# EAGLE design AmpliTR (EAGLE 7.2.0)
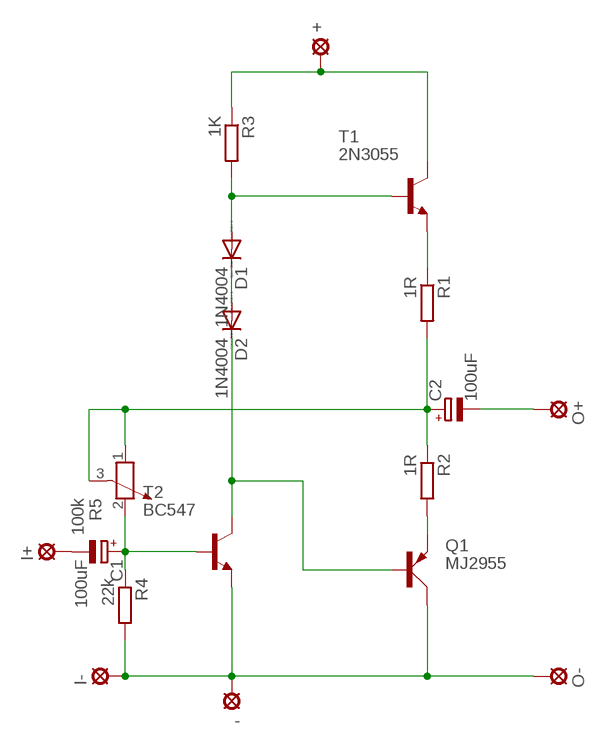
[diagram p0: schematic, sheet 1]

## Parts
+  LSP10  [LSP10]
-  LSP10  [LSP10]
C1  100uF  CPOL-EUE2-5  [E2-5]
C2  100uF  CPOL-EUE2-5  [E2-5]
D1  1N4004  [DO41-10]
D2  1N4004  [DO41-10]
I+  LSP10  [LSP10]
I-  LSP10  [LSP10]
O+  LSP10  [LSP10]
O-  LSP10  [LSP10]
Q1  MJ2955  [TO3A]
R1  1R  R-EU_0414/5V  [0414V]
R2  1R  R-EU_0414/5V  [0414V]
R3  1K  R-EU_0414/5V  [0414V]
R4  22k  R-EU_0414/5V  [0414V]
R5  100k  POTENTIOMETER_PT-10S  [PT-10S]
T1  2N3055  [TO3]
T2  BC547  [TO92]

## Nets
N$1: D1.C D2.A
N$2: D1.A R3.2 T1.B
N$3: +.MP R3.1 T1.C T1.C/(C)
N$4: R1.1 T1.E
N$5: C2.+ R1.2 R2.1 R5.1 R5.3
N$6: Q1.E R2.2
N$7: -.MP I-.MP O-.MP Q1.C Q1.C1(C) R4.2 T2.1(E)
N$8: C1.+ R4.1 R5.2 T2.2(B)
N$11: D2.C Q1.B T2.3(C)
N$12: C2.- O+.MP
N$13: C1.- I+.MP

## Library data of the parts
+ - I+ I- O+ O- = solpad:LSP10: SOLDER PAD drill 1.0 mm, distributor Buerklin, 12H555
C1 C2 = rcl:CPOL-EU: POLARIZED CAPACITOR, European symbol
D1 D2 = diode:1N4004: DIODE general purpose rectifier, 1 A
Q1 = transistor-power:MJ2955: PNP TRANSISTOR
R1-R4 = rcl:R-EU_: RESISTOR, European symbol
R5 = rcl:POTENTIOMETER_: Potentiometer
T1 = transistor:2N3055: NPN TRANSISTOR
T2 = transistor:BC547: NPN TRANSISTOR

## Board
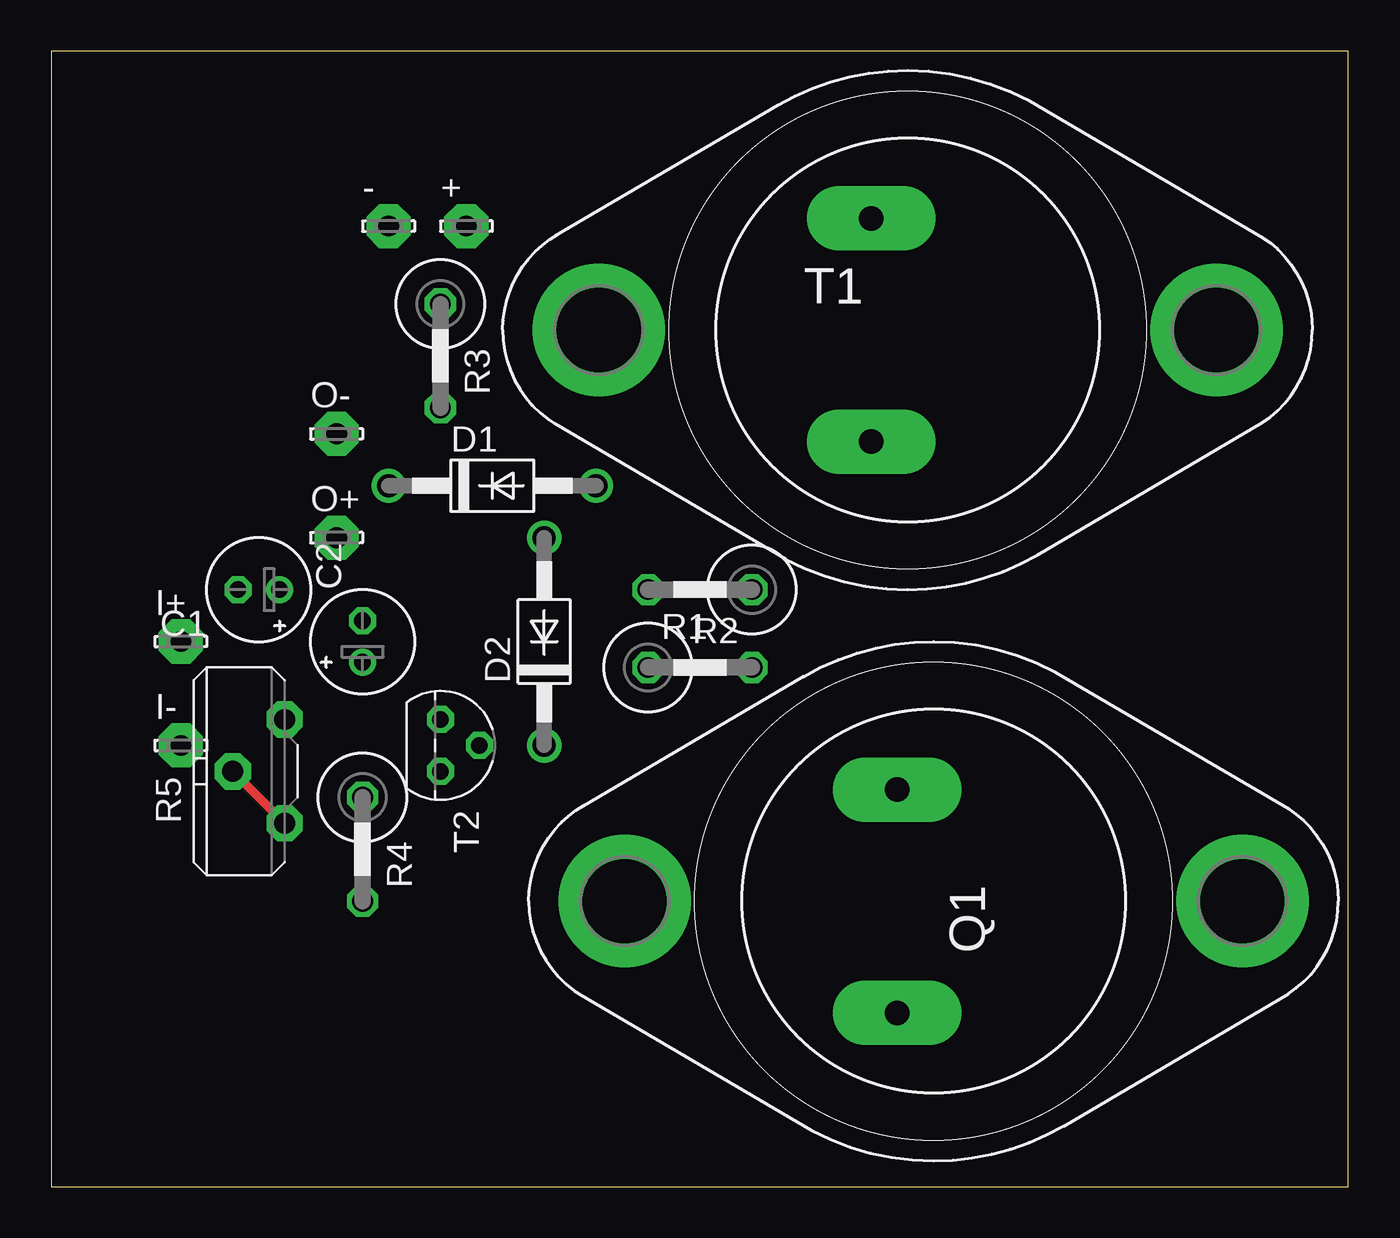
[diagram p1: board, top side]
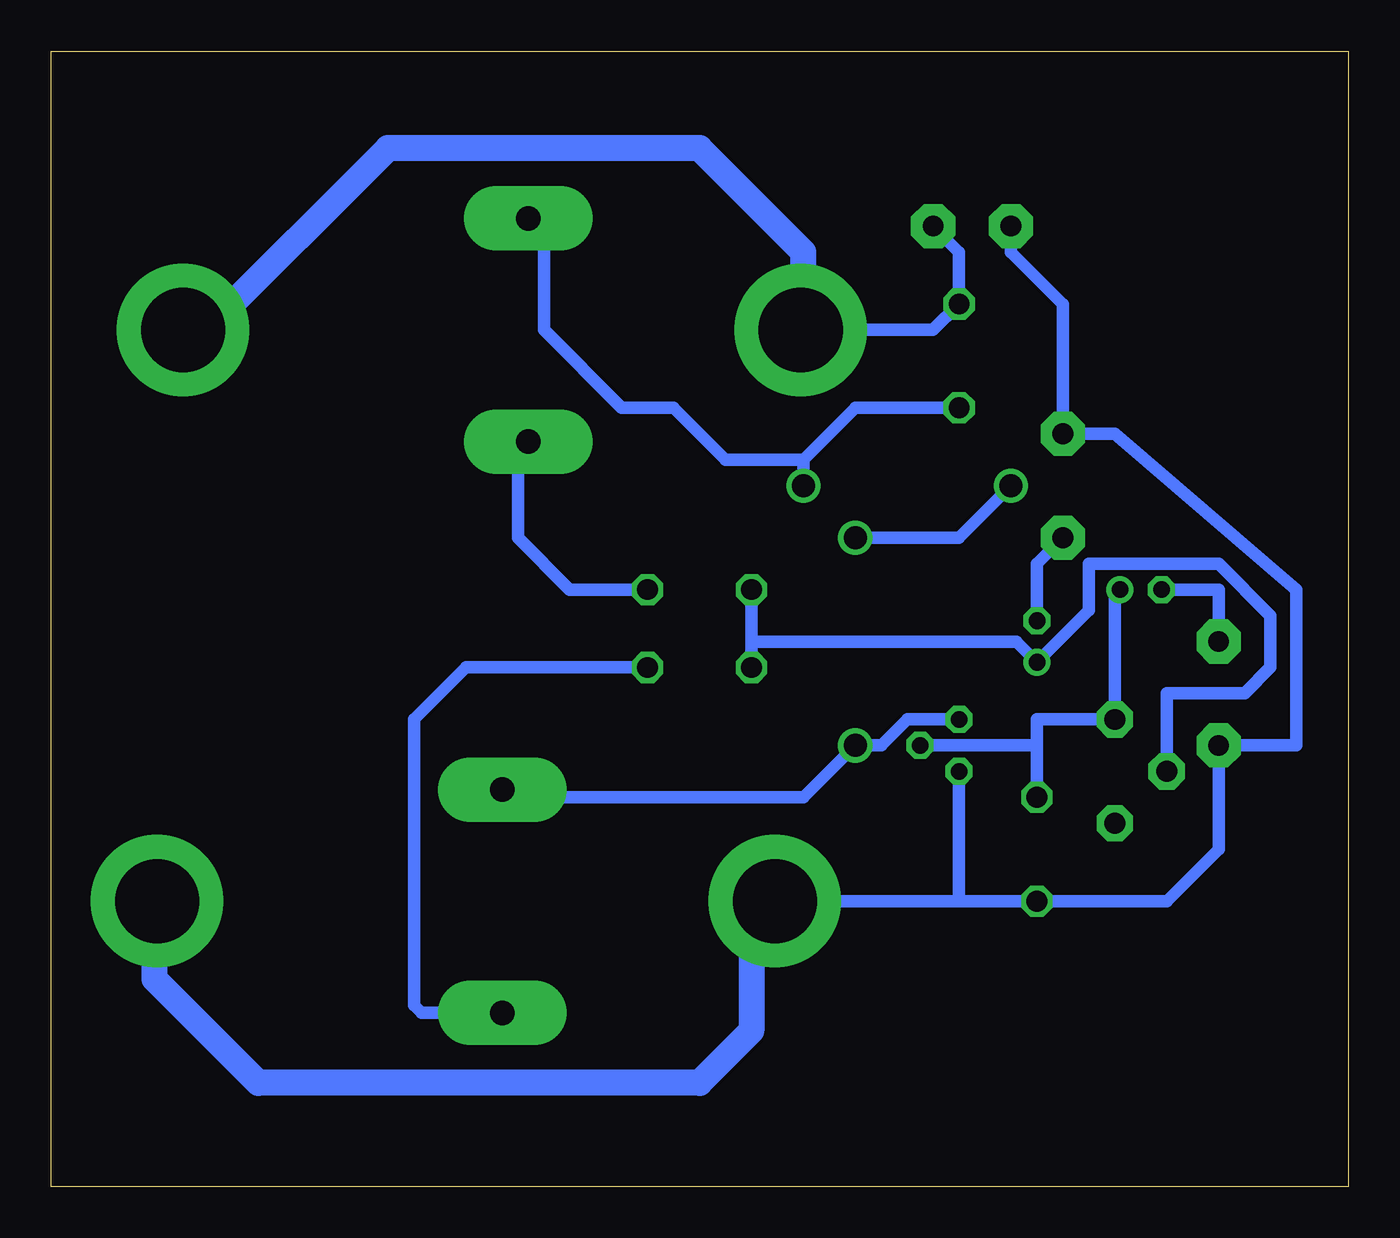
[diagram p2: board, bottom side, seen from below]

Size 63.48 x 55.55 mm. Coordinates in mm from the lower left corner, seen from the top.
Outline: 0,0 63.48,0 63.48,55.55 0,55.55 0,0
Copper layers (1*16): Top 0.035mm / dielectric 1.5mm / Bottom 0.035mm
Design rules "default": minimum track width 10mil, minimum drill 24mil, track to track 8mil, track to pad 8mil, pad to pad 8mil, via to via 8mil, smd to smd 8mil, copper to edge 40mil, drill to drill 8mil, minimum pad ring 10mil, minimum via ring 8mil, stop-mask expansion 4mil, vias tented up to drill 0mil, thermal gap 10mil

### Footprints (pad centres in the part's own frame; a part is rotated, then mirrored left to right if it is on the bottom)
LSP10 = drill 1.016 pad 2.159 octagon: MP 0,0
E2-5 = drill 0.813 pad 1.27: + -1.016,0 | drill 0.813 pad 1.27 octagon: - 1.016,0
DO41-10 = drill 1.118: A 5.08,0; C -5.08,0
TO3A = drill 1.194 pad 3.15 long: B -1.778,5.461; E -1.778,-5.461 | drill 4.115 pad 6.477: C 15.113,0; C1 -15.113,0
0414V = drill 1.016 octagon: 1 -2.54,0; 2 2.54,0
PT-10S = drill 1.016 pad 1.778 octagon: 1 -2.54,-1.27; 2 2.54,-1.27; 3 0,1.27
TO3 = drill 1.194 pad 3.15 long: B -1.778,5.461; E -1.778,-5.461 | drill 4.115 pad 6.477: C 15.113,0; C/ -15.113,0
TO92 = drill 0.813 octagon: 1 1.27,0; 2 0,1.905; 3 -1.27,0

### Placement (x,y rotation side)
+  20.32,46.99 0 top
-  16.51,46.99 0 top
C1  10.16,29.21 180 top
C2  15.24,26.67 90 top
D1  21.59,34.29 0 top
D2  24.13,26.67 90 top
I+  6.35,26.67 0 top
I-  6.35,21.59 0 top
O+  13.97,31.75 0 top
O-  13.97,36.83 0 top
Q1  43.18,13.97 0 top
R1  31.75,29.21 180 top
R2  31.75,25.4 0 top
R3  19.05,40.64 270 top
R4  15.24,16.51 270 top
R5  10.16,20.32 90 top
T1  41.91,41.91 0 top
T2  19.05,21.59 270 top

### Tracks (layer width: path | path; a pad name or v marks a point on that pad's centre or on a via)
N$1
  Bottom 0.61: D1.C 19.05,31.75 D2.A
N$2
  Bottom 0.61: R3.2 24.13,38.1 26.67,35.56 | 26.67,35.56 D1.A | T1.B 39.37,46.61 39.37,41.91 35.56,38.1 33.02,38.1 30.48,35.56 26.67,35.56
N$3
  Bottom 0.61: +.MP 19.05,45.72 R3.1 20.32,41.91 26.67,41.91 T1.C/
  Bottom 1.27: 26.67,41.91 26.67,45.72 31.75,50.8 46.99,50.8 55.88,41.91 57.15,41.91
N$4
  Bottom 0.61: R1.1 38.1,29.21 40.64,31.75 40.64,35.56 40.13,36.07 T1.E
N$5
  Top 0.406: R5.1 R5.3
  Bottom 0.61: R1.2 29.21,26.67 | 29.21,26.67 R2.1 | 29.21,26.67 16.26,26.67 C2.+ 12.7,28.19 12.7,30.48 6.35,30.48 3.81,27.94 3.81,25.4 5.08,24.13 8.89,24.13 R5.3
N$6
  Bottom 0.61: R2.2 43.18,25.4 45.72,22.86 45.72,8.89 45.34,8.51 Q1.E
N$7
  Bottom 0.61: 19.05,13.97 R4.2 8.89,13.97 6.35,16.51 I-.MP 2.54,21.59 2.54,29.21 11.43,36.83 O-.MP 13.97,43.18 16.51,45.72 -.MP | 19.05,13.97 27.94,13.97 Q1.C1 | T2.1 19.05,13.97
  Bottom 1.27: 27.94,13.97 29.21,12.7 29.21,7.62 31.75,5.08 53.34,5.08 58.42,10.16 58.42,13.97
N$8
  Bottom 0.61: R4.1 15.24,21.59 | 15.24,21.59 15.24,22.86 R5.2 11.43,28.96 C1.+ | T2.2 15.24,21.59
N$11
  Bottom 0.61: T2.3 21.59,22.86 22.86,21.59 D2.C 26.67,19.05 41.02,19.05 Q1.B
N$12
  Bottom 0.61: O+.MP 15.24,30.48 C2.-
N$13
  Bottom 0.61: I+.MP 6.35,29.21 C1.-